# Altium schematic sheet bitslot.SchDoc
size A4
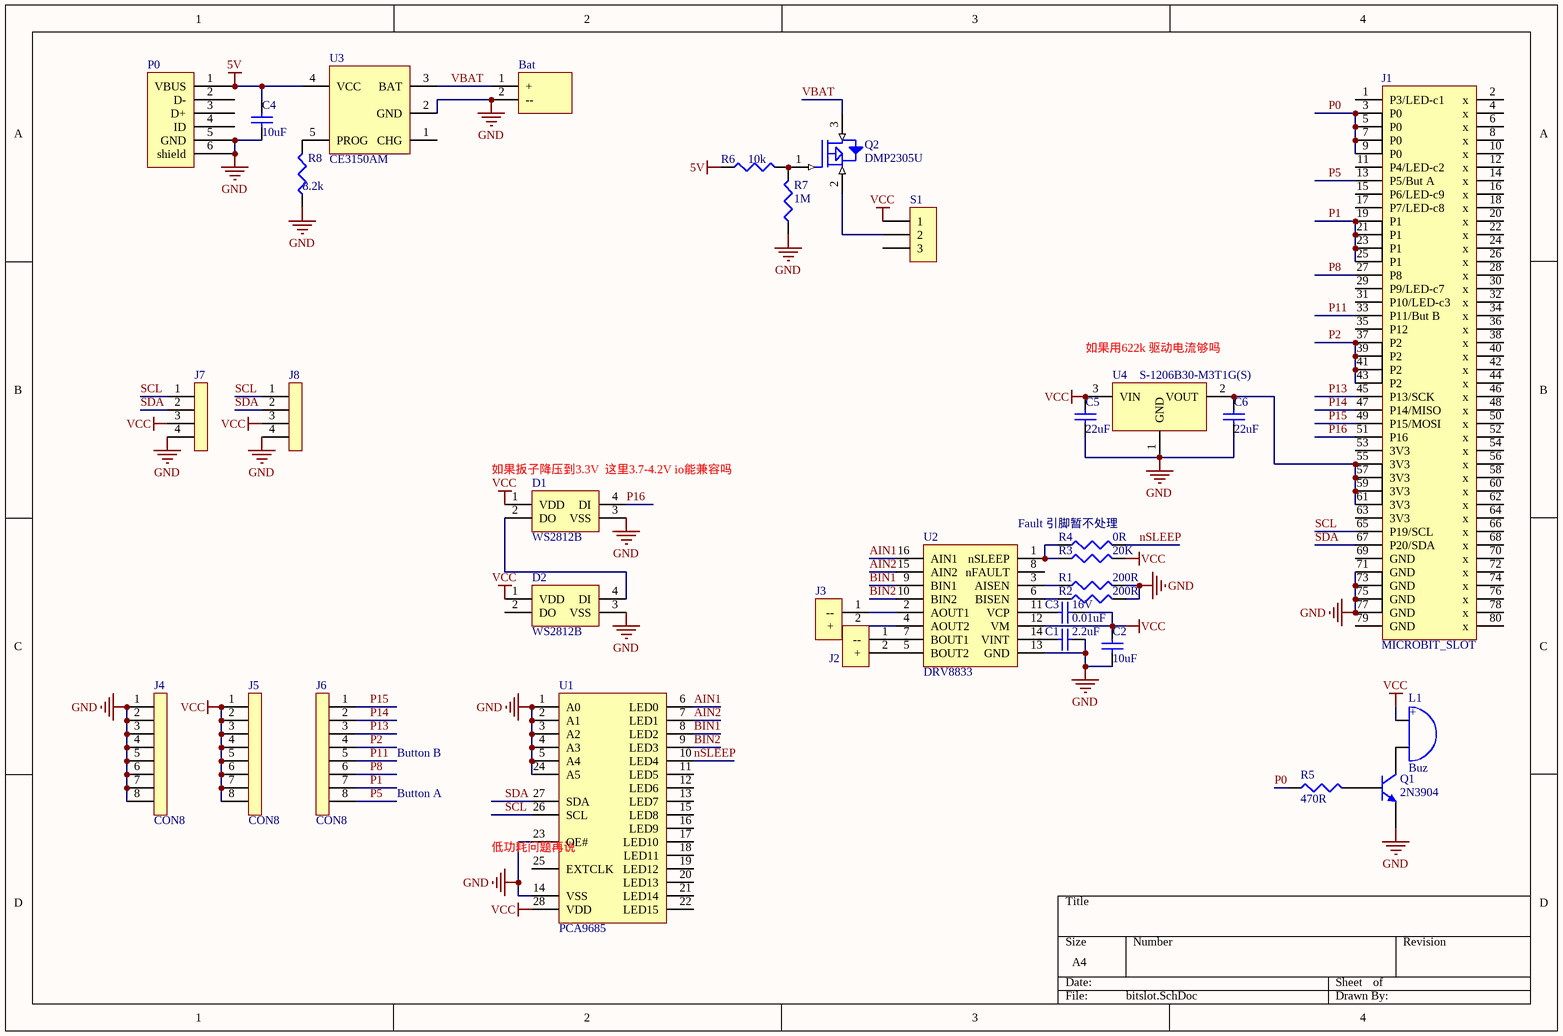
[diagram p0: bitslot.SchDoc]

## Parts
Bat  (no value)  [BAT-2040]
C1  value 2.2uF  [C0603]
C2  value 10uF  [C0603]
C3  16V  value 0.01uF  [C0603]
C4  value 10uF  [C0603]
C5  value 22uF  [C0603]
C6  value 22uF  [C0603]
D1  WS2812B  [WS2812B]
D2  WS2812B  [WS2812B]
J1  MICROBIT_SLOT  [microbit_slot]
J2  (no value)  [S2B-PH-K-S]
J3  (no value)  [S2B-PH-K-S]
J4  CON8  [CON8]
J5  CON8  [CON8]
J6  CON8  [CON8]
J7  (no value)  [CON4]
J8  (no value)  [CON4]
L1  Buz  [Buzzer]
P0  (no value)  [USB_MICRO]
Q1  2N3904  [SOT23-3]
Q2  DMP2305U  [SOT23-3]
R1  200R  [R0603]
R2  200R  [R0603]
R3  20K  [R0603]
R4  0R  [R0603]
R5  470R  [R0603]
R6  10k  [R0603]
R7  1M  [R0603]
R8  8.2k  [R0603]
S1  (no value)  [SWITCH-1]
U1  PCA9685  [TSSOP-28]
U2  DRV8833  [TSSOP-16]
U3  CE3150AM  [SOT23-5]
U4  S-1206B30-M3T1G(S)  [SOT23-3]

## Nets
5V: C4.2 P0.1(VBUS) R6.1 U3.4(VCC)
GND: Bat.2(--) C1.2 C2.1 C4.1 C5.1 C6.1 D1.3(VSS) D2.3(VSS) J1.71(GND) J1.73(GND) J1.75(GND) J1.77(GND) J4.1 J4.2 J4.3 J4.4 J4.5 J4.6 J4.7 J4.8 J7.4 J8.4 P0.5(GND) P0.6(shield) Q1.1(E) R1.2 R2.2 R7.1 R8.1 U1.1(A0) U1.2(A1) U1.3(A2) U1.4(A3) U1.5(A4) U1.14(VSS) U1.23(OE#) U1.24(A5) U2.13(GND) U3.2(GND) U4.1(GND)
VCC: C2.2 C3.2 C5.2 D1.1(VDD) D2.1(VDD) J5.1 J5.2 J5.3 J5.4 J5.5 J5.6 J5.7 J5.8 J7.3 J8.3 L1.1(A) R3.2 S1.1 U1.28(VDD) U2.12(VM) U4.3(VIN)
AIN1: U1.6(LED0) U2.16(AIN1)
AIN2: U1.7(LED1) U2.15(AIN2)
BIN1: U1.8(LED2) U2.9(BIN1)
BIN2: U1.9(LED3) U2.10(BIN2)
nSLEEP: R4.2 U1.10(LED4)
P0: J1.3(P0) J1.5(P0) J1.7(P0) J1.9(P0) R5.1
P1: J1.19(P1) J1.21(P1) J1.23(P1) J1.25(P1) J6.7
P2: J1.37(P2) J1.39(P2) J1.41(P2) J1.43(P2) J6.4
P5: J1.13(P5/But_A) J6.8
P8: J1.27(P8) J6.6
P11: J1.33(P11/But_B) J6.5
P13: J1.45(P13/SCK) J6.3
P14: J1.47(P14/MISO) J6.2
P15: J1.49(P15/MOSI) J6.1
P16: D1.4(DI) J1.51(P16)
SCL: J1.65(P19/SCL) J7.1 J8.1 U1.26(SCL)
SDA: J1.67(P20/SDA) J7.2 J8.2 U1.27(SDA)
VBAT: Bat.1(+) Q2.3(D) U3.3(BAT)
NetC1_1: C1.1 U2.14(VINT)
NetC3_1: C3.1 U2.11(VCP)
NetC6_2: C6.2 J1.55(3V3) J1.57(3V3) J1.59(3V3) J1.61(3V3) U4.2(VOUT)
NetD1_2: D1.2(DO) D2.4(DI)
NetJ2_1: J2.1(--) U2.7(BOUT1)
NetJ2_2: J2.2(+) U2.5(BOUT2)
NetJ3_1: J3.1(--) U2.2(AOUT1)
NetJ3_2: J3.2(+) U2.4(AOUT2)
NetL1_2: L1.2(B) Q1.3(C)
NetQ1_2: Q1.2(B) R5.2
NetQ2_1: Q2.1(G) R6.2 R7.2
NetQ2_2: Q2.2(S) S1.2
NetR1_1: R1.1 U2.3(AISEN)
NetR2_1: R2.1 U2.6(BISEN)
NetR3_1: R3.1 R4.1 U2.1(nSLEEP)
NetR8_2: R8.2 U3.5(PROG)

Not connected (* = marked no-connect by the designer): D2 2(DO); J1 1(P3/LED-c1) 2(x) 4(x) 6(x) 8(x) 10(x) 11(P4/LED-c2) 12(x) 14(x) 15(P6/LED-c9) 16(x) 17(P7/LED-c8) 18(x) 20(x) 22(x) 24(x) 26(x) 28(x) 29(P9/LED-c7) 30(x) 31(P10/LED-c3) 32(x) 34(x) 35(P12) 36(x) 38(x) 40(x) 42(x) 44(x) 46(x) 48(x) 50(x) 52(x) 53(3V3) 54(x) 56(x) 58(x) 60(x) 62(x) 63(3V3) 64(x) 66(x) 68(x) 69(GND) 70(x) 72(x) 74(x) 76(x) 78(x) 79(GND) 80(x); P0 2(D-) 3(D+) 4(ID); S1 3; U1 11(LED5) 12(LED6) 13(LED7) 15(LED8) 16(LED9) 17(LED10) 18(LED11) 19(LED12) 20(LED13) 21(LED14) 22(LED15) 25(EXTCLK); U2 8(nFAULT); U3 1(CHG)

## Notes on the sheet
- 如果用622k 驱动电流够吗
- (near D1) 如果扳子降压到3.3V  这里3.7-4.2V io能兼容吗
- (near R4) Fault 引脚暂不处理
- Button B
- Button A
- (near U1) 低功耗问题再说
- (in symbol Buzzer) +

## Library data of the parts
Bat = Battery2040: 2x4cm Li-bat
C1-C6 = Cap: Published: 8-Jun-2000; LatestRevisionDate: 29-May-2009; LatestRevisionNote: IPC-7351 Footprint Added.; PackageReference: C1206; Publisher: Altium Limited; PackageDescription: Chip Capacitor
J2 J3 = CON2_power
J7 J8 = CON4
L1 = Buzzer: Published: 24-Mar-1999; LatestRevisionDate: 17-Jul-2002; LatestRevisionNote: Re-released for DXP Platform.; PackageReference: PIN2; Publisher: Altium Limited
P0 = micro_usb
Q1 = 2N3904: NPN General Purpose Amplifier; Published: 8-Jun-2000; LatestRevisionDate: 15-Jan-2003; LatestRevisionNote: PCB Footprint 'BCY-W3/D4.7' replaced; DatasheetVersion: 1997; PackageVersion: Sep-1998; PackageReference: TO-92A; Publisher: Altium Limited; PackageDescription: TO, Flat Index; 3 In-Line, Axial Leads; Body Dia. 4.5mm; Leads 0.51 x 0.48 mm (max); ComponentLink1Description: Manufacturer Link; ComponentLink1URL: http://www.fairchildsemi.com/; ComponentLink2Description: Datasheet; ComponentLink2URL: http://www.fairchildsemi.com/ds/2N%2F2N3904.pdf
Q2 = MOSFET P
R1-R8 = Res: Published: 8-Jun-2000; LatestRevisionDate: 29-May-2009; LatestRevisionNote: IPC-7351 Footprint Added.; PackageReference: J1-0603; Publisher: Altium Limited; PackageDescription: Chip Resistor
S1 = CON3: Header, 3-Pin; LatestRevisionDate: 17-Jul-2002; LatestRevisionNote: Re-released for DXP Platform.; Publisher: Altium Limited
U2 = DRV8833: TSSOP-16
U3 = CE3150AM: LI-Ion battery charger with Thermal Regulation
U4 = S-1206BXX